# Altium schematic sheet 3_SWD.SchDoc
size A; SheetNumber: 4; SheetTotal: 6
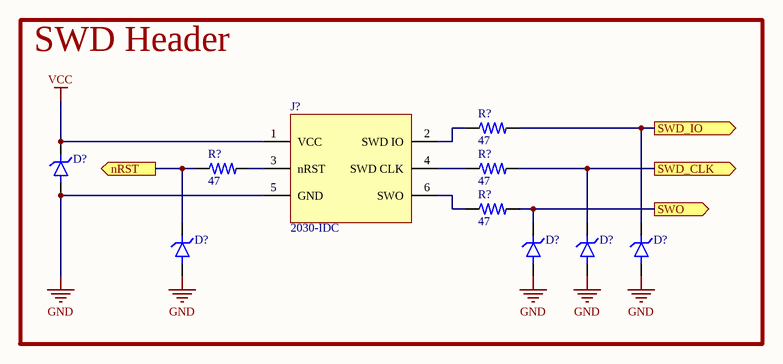
[diagram p0: 3_SWD.SchDoc]

## Parts
(Parts that share a designator on the sheet are numbered #1, #2 ... from top to bottom, then left to right.)
D?#1  RCLAMP0521P.TCT  [RCLAMP0521P.TCT]  (value not drawn)
D?#2  RCLAMP0521P.TCT  [RCLAMP0521P.TCT]  (value not drawn)
D?#3  RCLAMP0521P.TCT  [RCLAMP0521P.TCT]  (value not drawn)
D?#4  RCLAMP0521P.TCT  [RCLAMP0521P.TCT]  (value not drawn)
D?#5  RCLAMP0521P.TCT  [RCLAMP0521P.TCT]  (value not drawn)
J?  2030-IDC  [TAG CONNECT TC2030IDC - NO 3D MODEL]
R?#1  value 47  [0402R]  (hidden comment: RES)
R?#2  value 47  [0402R]  (hidden comment: RES)
R?#3  value 47  [0402R]  (hidden comment: RES)
R?#4  value 47  [0402R]  (hidden comment: RES)

## Blocks framed on the sheet
SWD Header: D?#1-D?#5 J? R?#1-R?#4

## Ports
nRST (out, see 2_MCU-BLE[3C]), SWD_CLK (out, see 2_MCU-BLE[4B]), SWD_IO (out, see 2_MCU-BLE[4B]), SWO (out, see 2_MCU-BLE[4B])

## Nets
GND: D?#1.A D?#2.A D?#3.A D?#4.A D?#5.A J?.5(GND)
VCC: D?#1.K J?.1(VCC)
nRST: D?#2.K R?#2.1 ; port nRST
SWD_CLK: D?#4.K R?#3.2 ; port SWD_CLK
SWD_IO: D?#5.K R?#1.2 ; port SWD_IO
SWO: D?#3.K R?#4.2 ; port SWO
NetJ?_2: J?.2(SWD_IO) R?#1.1
NetJ?_3: J?.3(nRST) R?#2.2
NetJ?_4: J?.4(SWD_CLK) R?#3.1
NetJ?_6: J?.6(SWO) R?#4.1

## Library data of the parts
D?#1-D?#5 = TVS DIODE: 25V Clamp 4A (8/20µs) Ipp Tvs Diode Surface Mount SLP1006P2; MFR: Semtech Corporation; Type: SMD; MFR PN: RCLAMP0521P.TCT; Value: RCLAMP0521P.TCT
J? = TAG CONNECT 2030-IDC: MFR PN: TC2030-IDC; Value: DNS; MFR: Tag Connect
R?#1-R?#4 = RES: Resistor; MFR PN: *; MFR: *; JLCPCB PN: *